# EAGLE schematic power-converter (EAGLE 6.3)
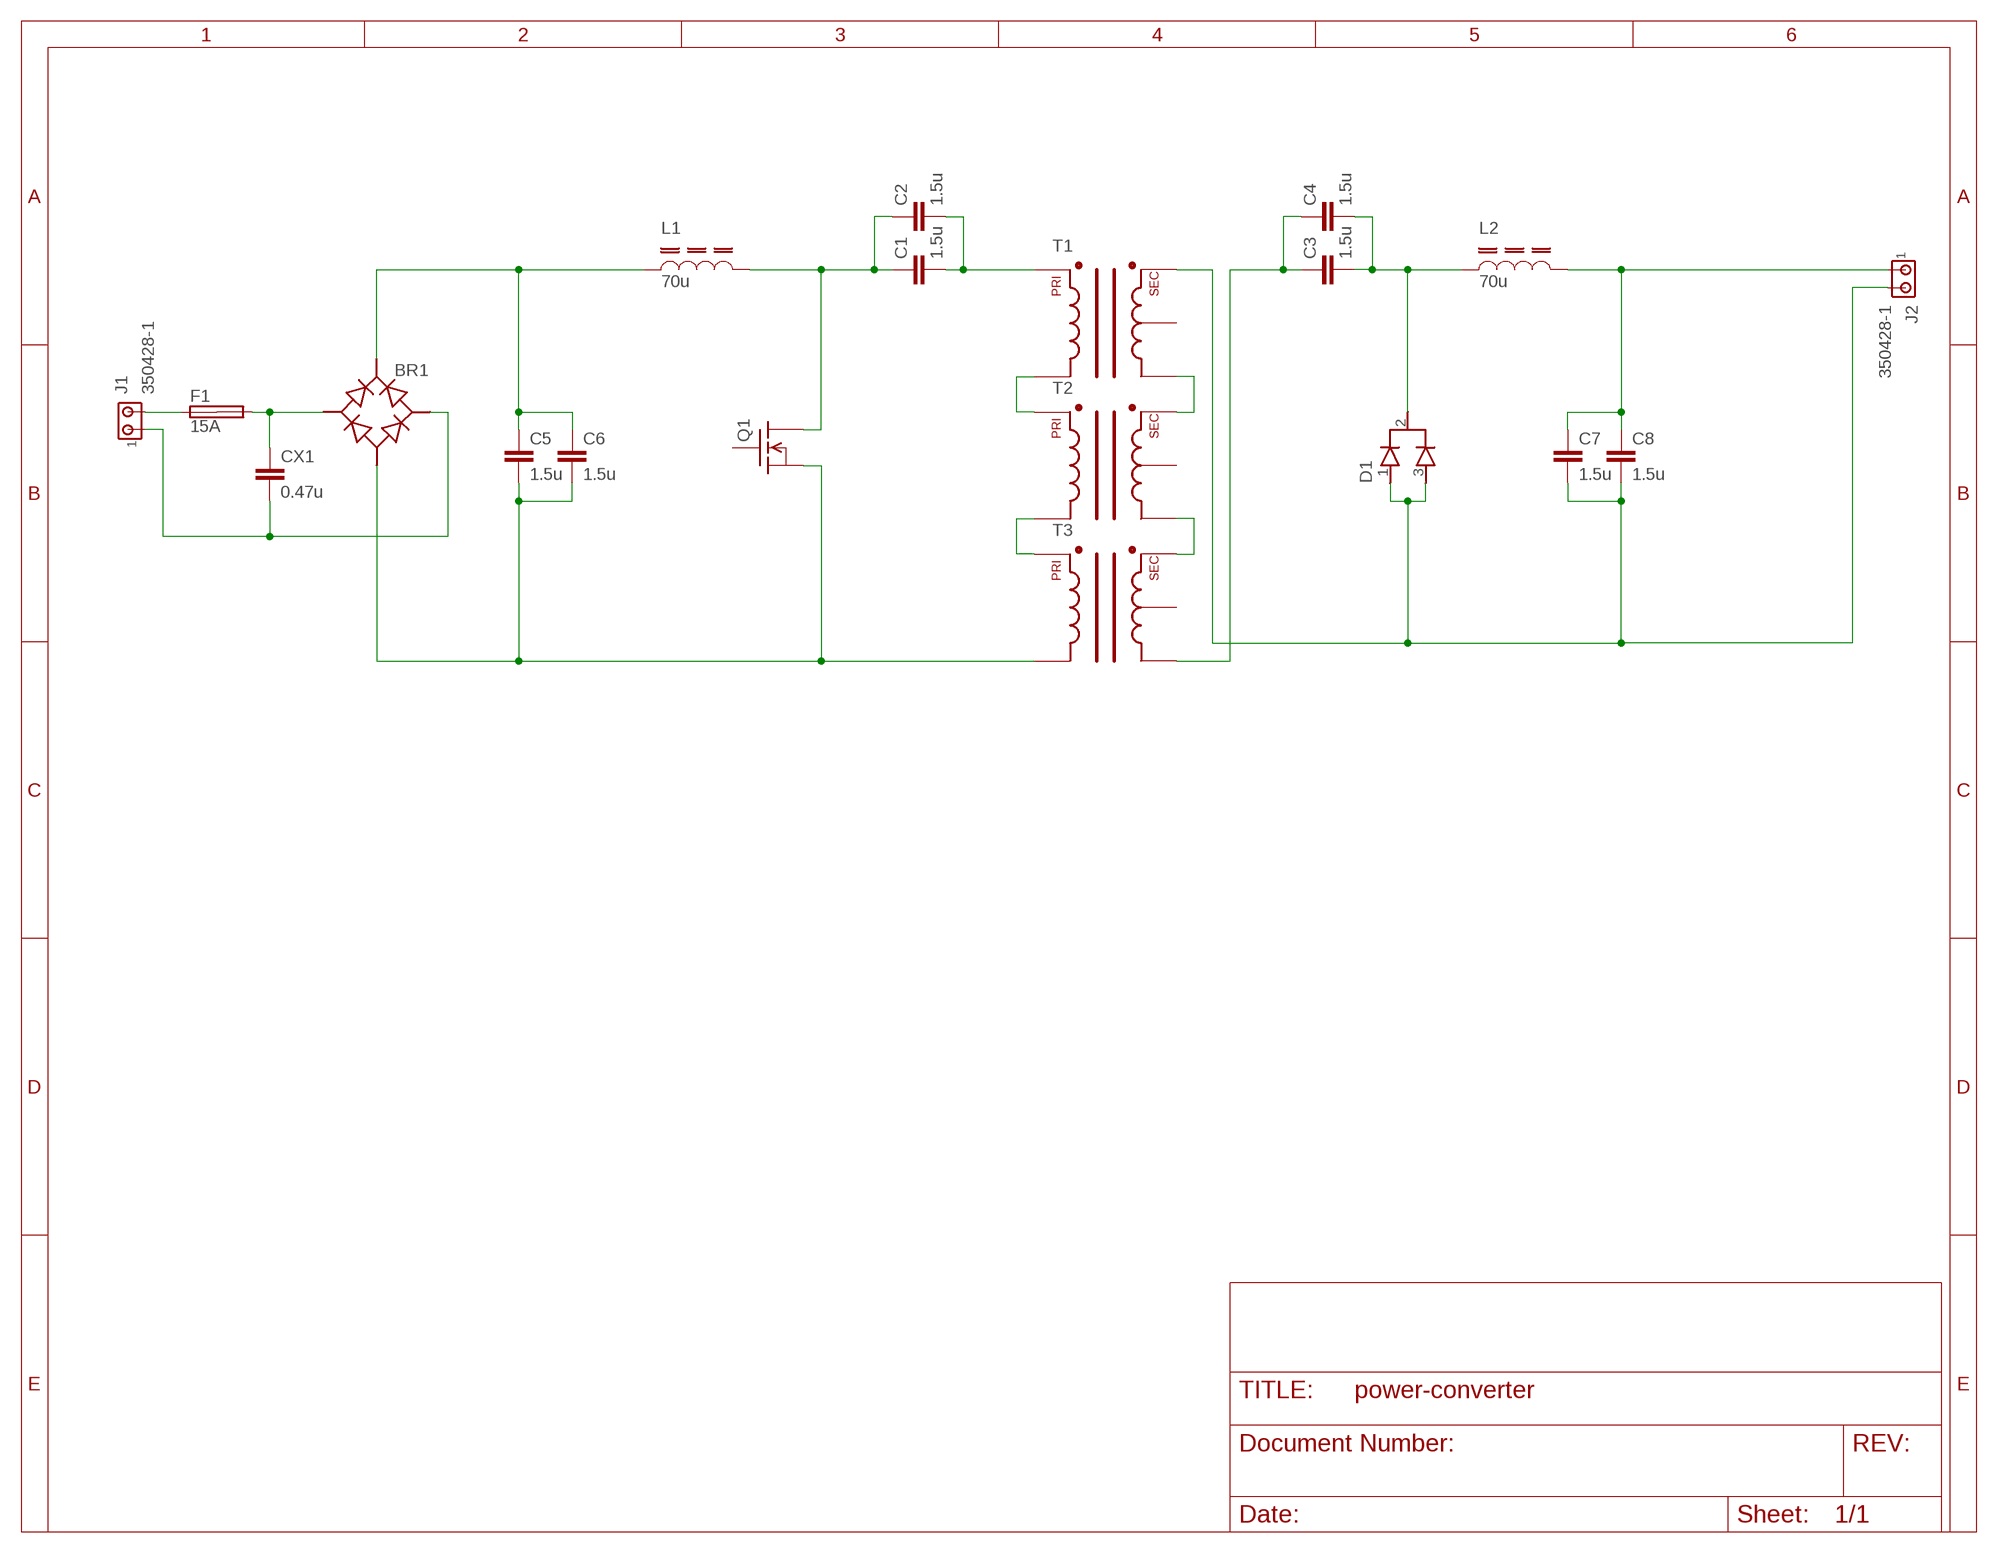
[diagram p0: schematic, sheet 1]

## Parts
BR1  DIODE_BRIDGE_RECTIFIERLVB2560  [GSIB-5S]
C1  1.5u  PANASONIC-ECWF-2155-B  [PANASONIC-ECWF-2155-B]
C2  1.5u  PANASONIC-ECWF-2155-B  [PANASONIC-ECWF-2155-B]
C3  1.5u  PANASONIC-ECWF-2155-B  [PANASONIC-ECWF-2155-B]
C4  1.5u  PANASONIC-ECWF-2155-B  [PANASONIC-ECWF-2155-B]
C5  1.5u  PANASONIC-ECWF-2155-B  [PANASONIC-ECWF-2155-B]
C6  1.5u  PANASONIC-ECWF-2155-B  [PANASONIC-ECWF-2155-B]
C7  1.5u  PANASONIC-ECWF-2155-B  [PANASONIC-ECWF-2155-B]
C8  1.5u  PANASONIC-ECWF-2155-B  [PANASONIC-ECWF-2155-B]
CX1  0.47u  CXXC22B7  [XC22B7]
D1  DIODE-COMMON_CATHODETO-247  [TO247BV]
F1  15A  SH32  [SH32]
J1  350428-1  [350428-1]
J2  350428-1  [350428-1]
L1  70u  COIL-WINDING-SPECIALIST_E70340-016  [COIL-WINDING-SPECIALIST_E70340-016]
L2  70u  COIL-WINDING-SPECIALIST_E70340-016  [COIL-WINDING-SPECIALIST_E70340-016]
Q1  N-MOS(G,D,S)TO-220A  [TO220AV]
T1  PAYTON_755001  [PAYTON_755001]
T2  PAYTON_755001  [PAYTON_755001]
T3  PAYTON_755001  [PAYTON_755001]

## Nets
N$1: BR1.AC1 CX1.1 F1.2A
N$2: BR1.AC2 CX1.2 J1.1
N$3: F1.1A J1.2
N$4: BR1.NEG C5.2 C6.2 Q1.3(S) T3.8,9(PRI_UNDOT)
N$5: T2.8,9(PRI_UNDOT) T3.1,2(PRI_DOT)
N$6: T1.8,9(PRI_UNDOT) T2.1,2(PRI_DOT)
N$7: T2.16,17,18(SEC_UNDOT) T3.10,11,12(SEC_DOT)
N$8: T1.16,17,18(SEC_UNDOT) T2.10,11,12(SEC_DOT)
N$9: C3.1 C4.1 T3.16,17,18(SEC_UNDOT)
N$10: C3.2 C4.2 D1.2(CATHODE) L2.1_B L2.1_T
N$11: BR1.POS C5.1 C6.1 L1.1_B L1.1_T
N$12: C7.2 C8.2 D1.1(ANODE) D1.3(ANODE) J2.2 T1.10,11,12(SEC_DOT)
N$13: C7.1 C8.1 J2.1 L2.2_B L2.2_T
N$15: C1.1 C2.1 L1.2_B L1.2_T Q1.2(D)
N$16: C1.2 C2.2 T1.1,2(PRI_DOT)
Unconnected: F1.1B F1.2B Q1.1(G) T1.13,14,15(SEC_CENTERTAP) T2.13,14,15(SEC_CENTERTAP) T3.13,14,15(SEC_CENTERTAP)

## Library data of the parts
BR1 = m_diode:DIODE_BRIDGE_RECTIFIER: Low VF Single-Phase Single In-Line Bridge Rectifiers PRIMARY CHARACTERISTICS IF(AV) 25 A VRRM 600 V IFSM 550 A IR 10 μA VF atIF =12.5A,TA =125°C 0.76 V TJ max. 150 °C Added 12/19/2012 from Vishay document number 89393 revision 20-Dec-10; MANUF: Vishay; PARTNUM: LVB2560
C1-C8 = m_capacitor:PANASONIC-ECWF-: Panasonic Metallized Polypropylene Film Capacitor Designed for high current and frequency applications "B" Variant is larger, more available; PARTNUM: ECWF2155XB
CX1 = resistor:CX: X CAPACITOR for power line; MANUF: Kemet; PARTNUM: PHE840MY6470MD14R06L2
D1 = m_diode:DIODE-COMMON_CATHODE: Common Cathode Diode Pair; MANUF: CREE; PARTNUM: C3D20060D
F1 = fuse:SH32: FUSE HOLDER 6 x 32 mm, SH contact, SHH3N Schukat, 102071 Wickmann (Buerklin); MPN: 10207101009; OC_FARNELL: 811786; OC_NEWARK: 76R6904
J1 J2 = con-amp:350428-1: Universal MATE-N-LOK .250" Centerline, 600 V, 19 - 36 A max Source: http://catalog.tycoelectronics.com/ .. ENG_CD_350428_Y.pdf; MF: TYCO ELECTRONICS; MPN: 350428-1; OC_FARNELL: 285304; OC_NEWARK: 46F2051
L1 L2 = m_inductor:COIL-WINDING-SPECIALIST_E70340-016: Coil Winding Specialist, Inc. Helical Inductor E70340-016 100uH, 70uH at 25A DC Added 12/18/2012, drawing rev. A1; MANUF: Coil Winding Specialist, Inc.; PARTNUM: E70340-016
Q1 = m_transistor:N-MOS(G,D,S): N-channel MOSFET with Pin1:G, Pin2:D, Pin3:S; MANUF: ST; PARTNUM: STP57N65M5
T1-T3 = m_inductor:PAYTON_755001: Payton Planar Magnetics Power Transformer UP TO 350 W OFF THE SHELF SMT PLANAR TRANSFORMERS Power Range: up to 350W Input Voltage 18-36 Vdc or 36-72 Vdc. Height : 12 mm to 14.5 mm Max. Footprint : 30.0mm x 25.0 mm Max. Frequency Range : 200 kHz to 400 kHz Isolation (Primary to Secondary & Core): 1500Vdc. Part number 755001, Lm=20uH, n=2/3 Added 12/18/2012; MANUF: Payton Planar; PARTNUM: 755001